# Altium schematic sheet XDS_100_USB_Programmer.SchDoc
size Letter; DocumentNumber: 5; SheetNumber: 5; SheetTotal: 9
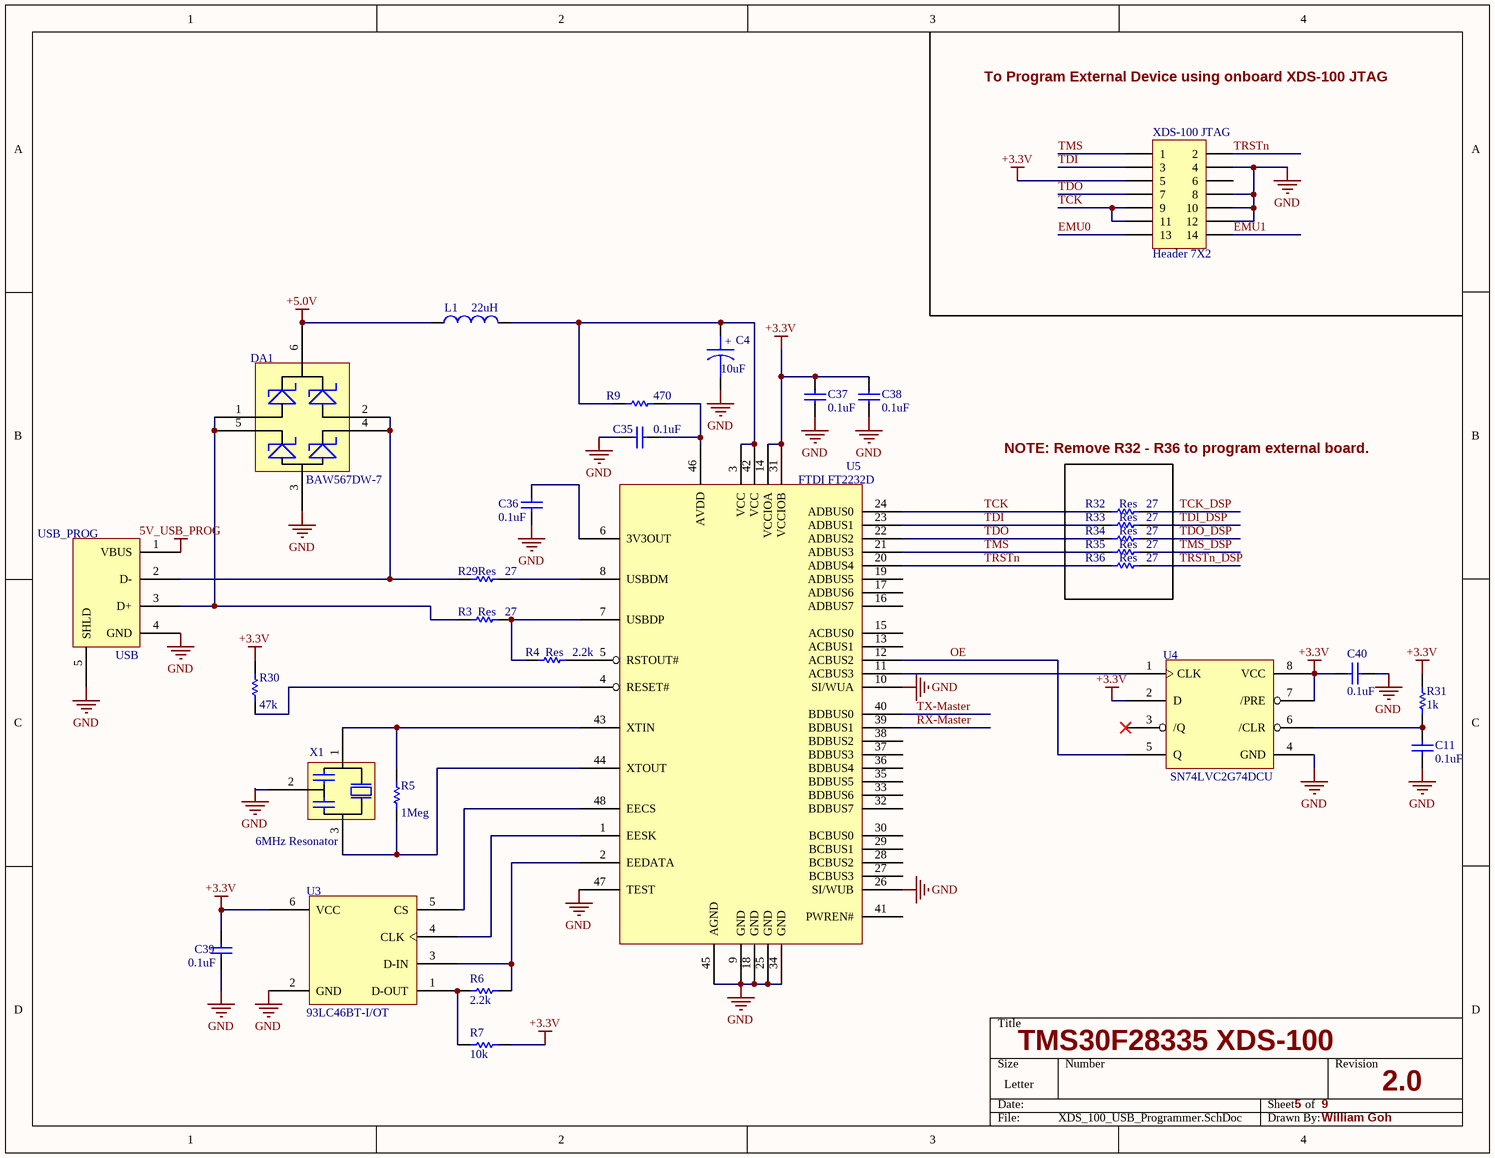
[diagram p0: XDS_100_USB_Programmer.SchDoc]

## Parts
C4  value 10uF  [3528]  (hidden comment: Pol Cap)
C11  value 0.1uF  [0805]  (hidden comment: Cap Semi)
C35  value 0.1uF  [0805]  (hidden comment: Cap Semi)
C36  value 0.1uF  [0805]  (hidden comment: Cap Semi)
C37  value 0.1uF  [0805]  (hidden comment: Cap Semi)
C38  value 0.1uF  [0805]  (hidden comment: Cap Semi)
C39  value 0.1uF  [0805]  (hidden comment: Cap Semi)
C40  value 0.1uF  [0805]  (hidden comment: Cap Semi)
DA1  BAW567DW-7  [BAW567DW]
L1  value 22uH  [0805]  (hidden comment: Inductor)
R3  Res  value 27  [0805]
R4  Res  value 2.2k  [0805]
R5  value 1Meg  [0805]  (hidden comment: Res)
R6  value 2.2k  [0805]  (hidden comment: Res)
R7  value 10k  [0805]  (hidden comment: Res)
R9  value 470  [0805]  (hidden comment: Res)
R29  Res  value 27  [0805]
R30  value 47k  [0805]  (hidden comment: Res)
R31  value 1k  [0805]  (hidden comment: Res)
R32  Res  value 27  [0805]
R33  Res  value 27  [0805]
R34  Res  value 27  [0805]
R35  Res  value 27  [0805]
R36  Res  value 27  [0805]
U3  93LC46BT-I/OT  [93LC46BT-I/OT]
U4  SN74LVC2G74DCU  [DCU8]
U5  FTDI FT2232D  [FTDI FT2232D]
USB_PROG  USB  [USB_TypeB_RightAngle]
X1  6MHz Resonator  [6.00Mhz Resonator]
XDS-100_JTAG  Header 7X2  [HDR2X7]

## Nets
5V_USB_PROG: USB_PROG.1(VBUS)
+3.3V: C37.2 C38.1 C39.2 C40.2 R7.1 R30.2 R31.2 U3.6(VCC) U4.2(D) U4.7(/PRE) U4.8(VCC) U5.14(VCCIOA) U5.31(VCCIOB) XDS-100_JTAG.5
+5.0V: DA1.6 L1.1
GND: C4.2 C11.2 C35.2 C36.1 C37.1 C38.2 C39.1 C40.1 DA1.3 U3.2(GND) U4.4(GND) U5.9(GND) U5.10(SI/WUA) U5.18(GND) U5.25(GND) U5.26(SI/WUB) U5.34(GND) U5.45(AGND) U5.47(TEST) USB_PROG.4(GND) USB_PROG.5(SHLD) X1.2(GND) XDS-100_JTAG.4 XDS-100_JTAG.8 XDS-100_JTAG.10 XDS-100_JTAG.12
EMU0: XDS-100_JTAG.13
EMU1: XDS-100_JTAG.14
OE: U4.5(Q) U5.12(ACBUS2)
RX-Master: U5.39(BDBUS1)
TCK: R32.1 U5.24(ADBUS0) XDS-100_JTAG.9 XDS-100_JTAG.11
TCK_DSP: R32.2
TDI: R33.1 U5.23(ADBUS1) XDS-100_JTAG.3
TDI_DSP: R33.2
TDO: R34.1 U5.22(ADBUS2) XDS-100_JTAG.7
TDO_DSP: R34.2
TMS: R35.1 U5.21(ADBUS3) XDS-100_JTAG.1
TMS_DSP: R35.2
TRSTn: R36.1 U5.20(ADBUS4) XDS-100_JTAG.2
TRSTn_DSP: R36.2
TX-Master: U5.40(BDBUS0)
NetC4_1: C4.1 L1.2 R9.2 U5.3(VCC) U5.42(VCC)
NetC11_1: C11.1 R31.1 U4.6(/CLR)
NetC35_1: C35.1 R9.1 U5.46(AVDD)
NetC36_2: C36.2 U5.6(3V3OUT)
NetDA1_1: DA1.1 DA1.5 R3.1 USB_PROG.3(D+)
NetDA1_2: DA1.2 DA1.4 R29.1 USB_PROG.2(D-)
NetR3_2: R3.2 R4.1 U5.7(USBDP)
NetR4_2: R4.2 U5.5(RSTOUT#)
NetR5_1: R5.1 U5.44(XTOUT) X1.3
NetR5_2: R5.2 U5.43(XTIN) X1.1
NetR6_1: R6.1 U3.3(D-IN) U5.2(EEDATA)
NetR6_2: R6.2 R7.2 U3.1(D-OUT)
NetR29_2: R29.2 U5.8(USBDM)
NetR30_1: R30.1 U5.4(RESET#)
NetU3_4: U3.4(CLK) U5.1(EESK)
NetU3_5: U3.5(CS) U5.48(EECS)
NetU4_1: U4.1(CLK) U5.11(ACBUS3)

Not connected (* = marked no-connect by the designer): U4 3(/Q)*; U5 13(ACBUS1) 15(ACBUS0) 16(ADBUS7) 17(ADBUS6) 19(ADBUS5) 27(BCBUS3) 28(BCBUS2) 29(BCBUS1) 30(BCBUS0) 32(BDBUS7) 33(BDBUS6) 35(BDBUS5) 36(BDBUS4) 37(BDBUS3) 38(BDBUS2) 41(PWREN#); XDS-100_JTAG 6

## Notes on the sheet
- To Program External Device using onboard XDS-100 JTAG
- NOTE: Remove R32 - R36 to program external board.
- TMS30F28335 XDS-100
- 2.0
- William Goh
- (in symbol CAPACITOR POL) +

## Library data of the parts
C4 = CAPACITOR POL: Capacitor Tantalum; Digikey #: 495-2203-1-ND
C11 C35-C40 = Cap Semi: Capacitor (Semiconductor SIM Model); Published: 8-Jun-2000; LatestRevisionDate: 17-Jul-2002; LatestRevisionNote: Re-released for DXP Platform.; PackageReference: C1206; Publisher: Altium Limited
DA1 = BAW567DW-7: QUAD SURFACE MOUNT SWITCHING DIODE ARRAY; Digikey #: BAW567DWDICT-ND
L1 = Inductor: Code_IEC: 1005; Published: 8-Jun-2000; LatestRevisionDate: 17-Jul-2002; LatestRevisionNote: Re-released for DXP Platform.; PackageReference: 0402-A; Publisher: Altium Limited; Code_JEITA: 0402; Digikey #: 490-4030-1-ND
R3-R7 R9 R29-R36 = Res Semi: Semiconductor Resistor; Published: 8-Jun-2000; LatestRevisionDate: 17-Jul-2002; LatestRevisionNote: Re-released for DXP Platform.; PackageReference: AXIAL-0.5; Publisher: Altium Limited
U3 = 93LC46BT-I/OT: 1K Microwire Compatible Serial EEPROM; Digikey #: 93LC46BT-I/OTCT-ND
U4 = LVC2G74: Single Positive-Edge-Triggered D-Type Flip-Flop with Clear and Preset; Digikey #: 296-12755-1-ND
X1 = Resonator Ceramic: Ceramic Resonator; Digikey #: 490-1218-1-ND
XDS-100_JTAG = Header 7X2: Header, 7-Pin, Dual row; LatestRevisionDate: 17-Jul-2002; LatestRevisionNote: Re-released for DXP Platform.; Publisher: Altium Limited; Digikey #: HRP14H-ND
U5 = FTDI FT2232D: Digikey #: 768-1010-1-ND
USB_PROG = USB: Digikey #: 151-1121-ND